# Altium schematic sheet CC2530核心板.SchDoc
size A4
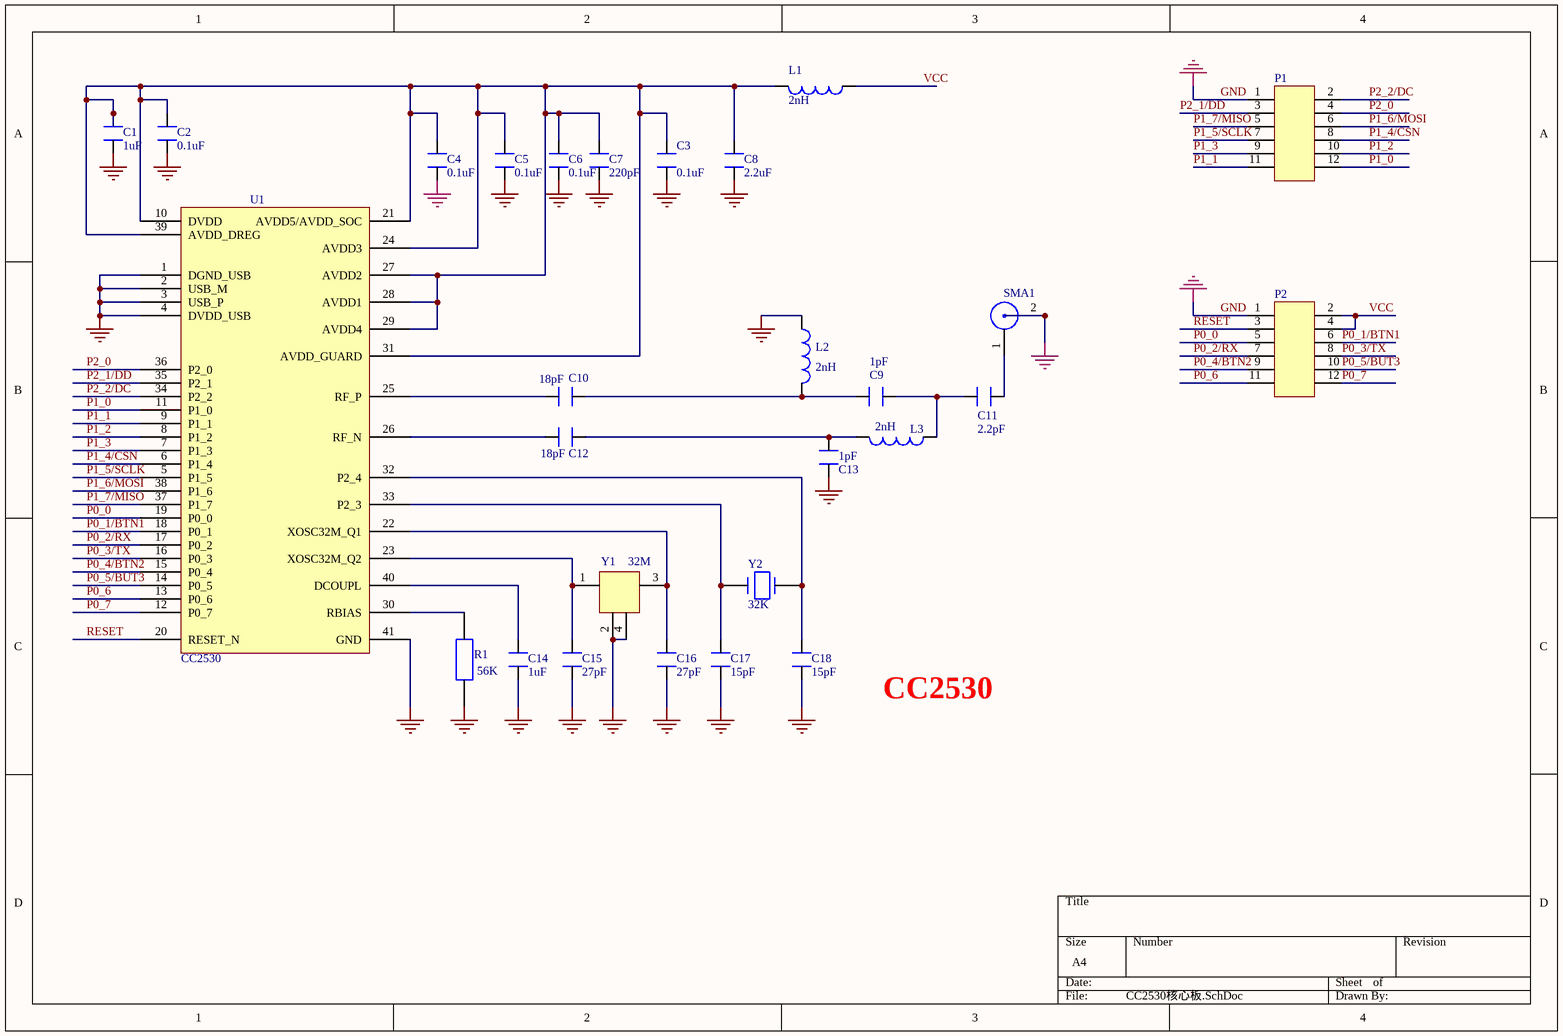
[diagram p0: CC2530核心板.SchDoc]

## Parts
C1  1uF  [C 0603_L]
C2  0.1uF  [C 0603_L]
C3  0.1uF  [C 0603_L]
C4  0.1uF  [C 0603_L]
C5  0.1uF  [C 0603_L]
C6  0.1uF  [C 0603_L]
C7  220pF  [C 0603_L]
C8  2.2uF  [C 0603_L]
C9  1pF  [C 0603_L]
C10  18pF  [C 0603_L]
C11  2.2pF  [C 0603_L]
C12  18pF  [C 0603_L]
C13  1pF  [C 0603_L]
C14  1uF  [C 0603_L]
C15  27pF  [C 0603_L]
C16  27pF  [C 0603_L]
C17  15pF  [C 0603_L]
C18  15pF  [C 0603_L]
L1  2nH  [L 0603]
L2  2nH  [L 0603]
L3  2nH  [L 0603]
P1  (no value)  [HDR2.54-LI-2x6P]
P2  (no value)  [HDR2.54-LI-2x6P]
R1  56K  [R 0603-HP_L]
SMA1  (no value)  [SMA-KE]
U1  CC2530  [QFN40]
Y1  32M  [OSC 3225-4P]
Y2  32K  [OSC 3215-2P]

## Nets
GND: C1.1 C2.2 C3.1 C4.1 C5.1 C6.1 C7.1 C8.1 C13.1 C14.2 C15.1 C16.1 C17.1 C18.1 L2.2 P1.1 P2.1 R1.1 SMA1.2 U1.1(DGND_USB) U1.2(USB_M) U1.3(USB_P) U1.4(DVDD_USB) U1.41(GND) Y1.2 Y1.4
P0_0: P2.5 U1.19(P0_0)
P0_1/BTN1: P2.6 U1.18(P0_1)
P0_2/RX: P2.7 U1.17(P0_2)
P0_3/TX: P2.8 U1.16(P0_3)
P0_4/BTN2: P2.9 U1.15(P0_4)
P0_5/BUT3: P2.10 U1.14(P0_5)
P0_6: P2.11 U1.13(P0_6)
P0_7: P2.12 U1.12(P0_7)
P1_0: P1.12 U1.11(P1_0)
P1_1: P1.11 U1.9(P1_1)
P1_2: P1.10 U1.8(P1_2)
P1_3: P1.9 U1.7(P1_3)
P1_4/CSN: P1.8 U1.6(P1_4)
P1_5/SCLK: P1.7 U1.5(P1_5)
P1_6/MOSI: P1.6 U1.38(P1_6)
P1_7/MISO: P1.5 U1.37(P1_7)
P2_0: P1.4 U1.36(P2_0)
P2_1/DD: P1.3 U1.35(P2_1)
P2_2/DC: P1.2 U1.34(P2_2)
RESET: P2.3 U1.20(RESET_N)
VCC: L1.2 P2.2 P2.4
NetC1_2: C1.2 C2.1 C3.2 C4.2 C5.2 C6.2 C7.2 C8.2 L1.1 U1.10(DVDD) U1.21(AVDD5/AVDD_SOC) U1.24(AVDD3) U1.27(AVDD2) U1.28(AVDD1) U1.29(AVDD4) U1.31(AVDD_GUARD) U1.39(AVDD_DREG)
NetC9_1: C9.1 C10.1 L2.1
NetC9_2: C9.2 C11.1 L3.2
NetC10_2: C10.2 U1.25(RF_P)
NetC11_2: C11.2 SMA1.1
NetC12_1: C12.1 C13.2 L3.1
NetC12_2: C12.2 U1.26(RF_N)
NetC14_1: C14.1 U1.40(DCOUPL)
NetC15_2: C15.2 U1.23(XOSC32M_Q2) Y1.1
NetC16_2: C16.2 U1.22(XOSC32M_Q1) Y1.3
NetC17_2: C17.2 U1.33(P2_3) Y2.1
NetC18_2: C18.2 U1.32(P2_4) Y2.2
NetR1_2: R1.2 U1.30(RBIAS)

## Notes on the sheet
- CC2530

## Library data of the parts
C1-C18 = C
L1-L3 = L
P1 = CON12: pin to pad: 1>11 2>12 3>9 4>10 5>7 6>8 7>5 8>6 9>3 10>4 11>1 12>2
P2 = CON12: pin to pad: 1>12 2>11 3>10 4>9 5>8 6>7 7>6 8>5 9>4 10>3 11>2 12>1
R1 = R
SMA1 = SMA